# EAGLE design AutoFeatherDoubler (EAGLE 9.4.0)
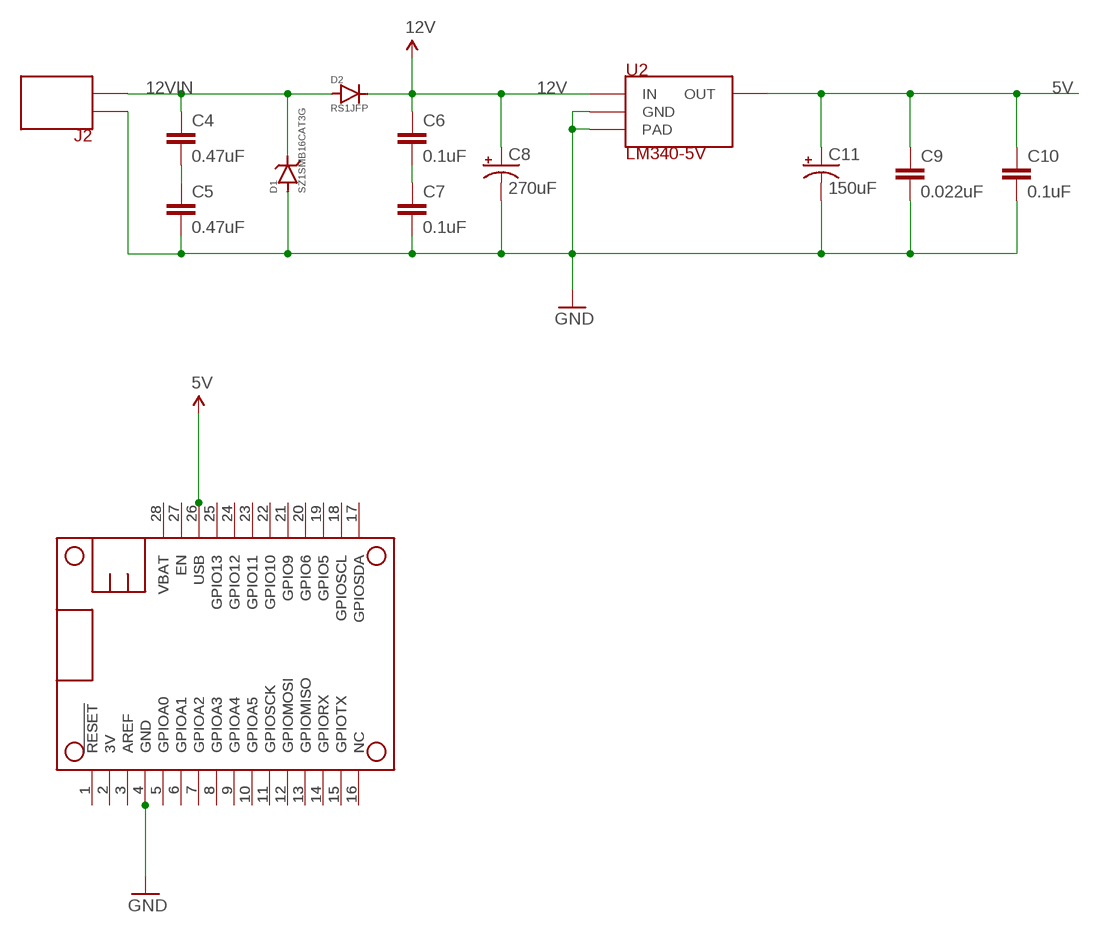
[diagram p0: schematic, sheet 1]

## Parts
C4  0.47uF  CAP-0.47UF-0805  [0805]
C5  0.47uF  CAP-0.47UF-0805  [0805]
C6  0.1uF  CAP-0.1UF-0603  [0603-CAP]
C7  0.1uF  CAP-0.1UF-0603  [0603-CAP]
C8  270uF  CAP-270UF-25V-RADIAL-PTH  [CAP-270UF-25V-RADIAL-PTH]
C9  0.022uF  CAP-0.022UF-0603  [0603-CAP]
C10  0.1uF  CAP-0.1UF-0603  [0603-CAP]
C11  150uF  CAP-150UF-25V-RADIAL-PTH  [CAP-150UF-25V-RADIAL-PTH]
D1  SZ1SMB16CAT3G  DIODE-TVS-SZ1SMB  [SZ1SMB]
D2  RS1JFP  DIODE-RS1JFP  [SOD-123HE-ON]
J2  TERMBLOCK-2X3.5MM  [TERMBLOCK-2X3.5MM]
MS1  FEATHERWING_NODIM  [FEATHERWING_DIM]
MS2  FEATHERWING_NODIM  [FEATHERWING_DIM]
U2  LM340-5V  LM340  [TO-263-3-TI]

## Nets
3V3: MS1.2(3V) MS2.2(3V)
5V: C9.1 C10.1 C11.+ MS1.26(USB) MS2.26(USB) U2.3(OUT)
12V: C6.1 C8.+ D2.1(CATHODE) U2.1(IN)
12VIN: C4.1 D1.C(CATHODE) D2.2(ANODE) J2.2
A0: MS1.5(GPIOA0) MS2.5(GPIOA0)
A1: MS1.6(GPIOA1) MS2.6(GPIOA1)
A2: MS1.7(GPIOA2) MS2.7(GPIOA2)
A3: MS1.8(GPIOA3) MS2.8(GPIOA3)
A4: MS1.9(GPIOA4) MS2.9(GPIOA4)
A5: MS1.10(GPIOA5) MS2.10(GPIOA5)
D2: MS1.19(GPIO5) MS2.19(GPIO5)
D3: MS1.20(GPIO6) MS2.20(GPIO6)
D4: MS1.21(GPIO9) MS2.21(GPIO9)
D5: MS1.22(GPIO10) MS2.22(GPIO10)
D6: MS1.23(GPIO11) MS2.23(GPIO11)
D7: MS1.24(GPIO12) MS2.24(GPIO12)
D8: MS1.25(GPIO13) MS2.25(GPIO13)
EN: MS1.27(EN) MS2.27(EN)
GND: C5.2 C7.2 C8.- C9.2 C10.2 C11.- D1.A(ANODE) J2.1 MS1.4(GND) MS2.4(GND) U2.2(GND) U2.PAD
MD: MS1.3(AREF) MS2.3(AREF)
MISO: MS1.13(GPIOMISO) MS2.13(GPIOMISO)
MOSI: MS1.12(GPIOMOSI) MS2.12(GPIOMOSI)
N$3: C4.2 C5.1
N$4: C6.2 C7.1
NC: MS1.16(NC) MS2.16(NC)
RESET: MS1.1(!RESET) MS2.1(!RESET)
RX: MS1.14(GPIORX) MS2.14(GPIORX)
SCK: MS1.11(GPIOSCK) MS2.11(GPIOSCK)
SCL: MS1.18(GPIOSCL) MS2.18(GPIOSCL)
SDA: MS1.17(GPIOSDA) MS2.17(GPIOSDA)
TX: MS1.15(GPIOTX) MS2.15(GPIOTX)
VBAT: MS1.28(VBAT) MS2.28(VBAT)

## Library data of the parts
C4 C5 = rickk2:CAP-0.47UF-0805: Wurth Electronics Inc. 885012207076 **not ordered yet** CAP CER 0.47UF 25V X7R 0805 0.47µF ±10% 25V Ceramic Capacitor X7R 0805 (2012 Metric) https://www.digikey.com/product-detail/en/wurth-electronics-inc/885012207076/732-7670-1-ND/5454297
C6 C7 C10 = rickk2:CAP-0.1UF-0603: CAP CER 0.1UF 16V X7R 0603 https://www.digikey.com/product-detail/en/murata-electronics-north-america/GRM188R71C104KA01D/490-1532-1-ND/587771
C8 = rickk2:CAP-270UF-25V-RADIAL-PTH: Wurth Electronics Inc. 860080474011 $0.36 **not ordered yet** CAP ALUM 270UF 20% 25V THRU HOLE 270µF 25V Aluminum Electrolytic Capacitors Radial, Can 3000 Hrs @ 105°C https://www.digikey.com/product-detail/en/wurth-electronics-inc/860080474011/732-9027-1-ND/5728970 Hole spacing: 3.5mm, lead size: 0.8mm, Diameter: 8.0mm
C9 = rickk2:CAP-0.022UF-0603: KEMET C0603C223K5RACTU $0.10 **not ordered yet** CAP CER 0.022UF (22nF) 50V X7R 0603 0.022µF ±10% 50V Ceramic Capacitor X7R 0603 (1608 Metric) https://www.digikey.com/product-detail/en/kemet/C0603C223K5RACTU/399-1280-1-ND/416056
C11 = rickk2:CAP-150UF-25V-RADIAL-PTH: Wurth Electronics Inc. 860020473010 $0.16 CAP ALUM 150UF 20% 25V RADIAL 150µF 25V Aluminum Electrolytic Capacitors Radial, Can 2000 Hrs @ 105°C https://www.digikey.com/product-detail/en/wurth-electronics-inc/860020473010/732-8827-1-ND/5728772 Hole spacing: 2.5mm, lead size: 0.8mm, Diameter: 6.3mm
D1 = rickk2:DIODE-TVS-SZ1SMB: Littelfuse Inc. SZ1SMB16CAT3G $0.97 **not purchased yet** TVS DIODE 16V 26V SMB 26V Clamp 23.1A Ipp Tvs Diode Surface Mount SMB https://www.digikey.com/products/en/circuit-protection/tvs-diodes/144?k=1SMB16CAT3G&k=&pkeyword=1SMB16CAT3G&sv=0&pv7=2&pv1989=0&sf=0&quantity=&ColumnSort=0&page=1&stock=1&pageSize=25 Unidirectional. Marking: LM Marking band on cathode side Device: DIODE-TVS-SZ1SMB
D2 = rickk2:DIODE-RS1JFP: Reverse voltage protection diode - not ordered yet! ON Semiconductor RS1JFP $0.44 DIODE GP 600V 1.2A SOD123HE Diode Standard 600V 1.2A Surface Mount SOD-123HE https://www.digikey.com/product-detail/en/on-semiconductor/RS1JFP/RS1JFPCT-ND/5722970 Used in Ford open power supply 1=Cathode=Large Pad=side with band 2=Anode=Small Pad
J2 = rickk2:TERMBLOCK-2X3.5MM
MS1 MS2 = microbuilder:FEATHERWING
U2 = rickk2:LM340: Texas Instruments LM340SX-5.0/NOPB $1.58 **not purchased yet** IC REG LIN 5V 1A DDPAK/TO263-3 Linear Voltage Regulator IC Positive Fixed 1 Output 1.5A DDPAK/TO-263-3 https://www.digikey.com/products/en?keywords=LM340SX-5.0%2FNOPBCT-ND

## Board
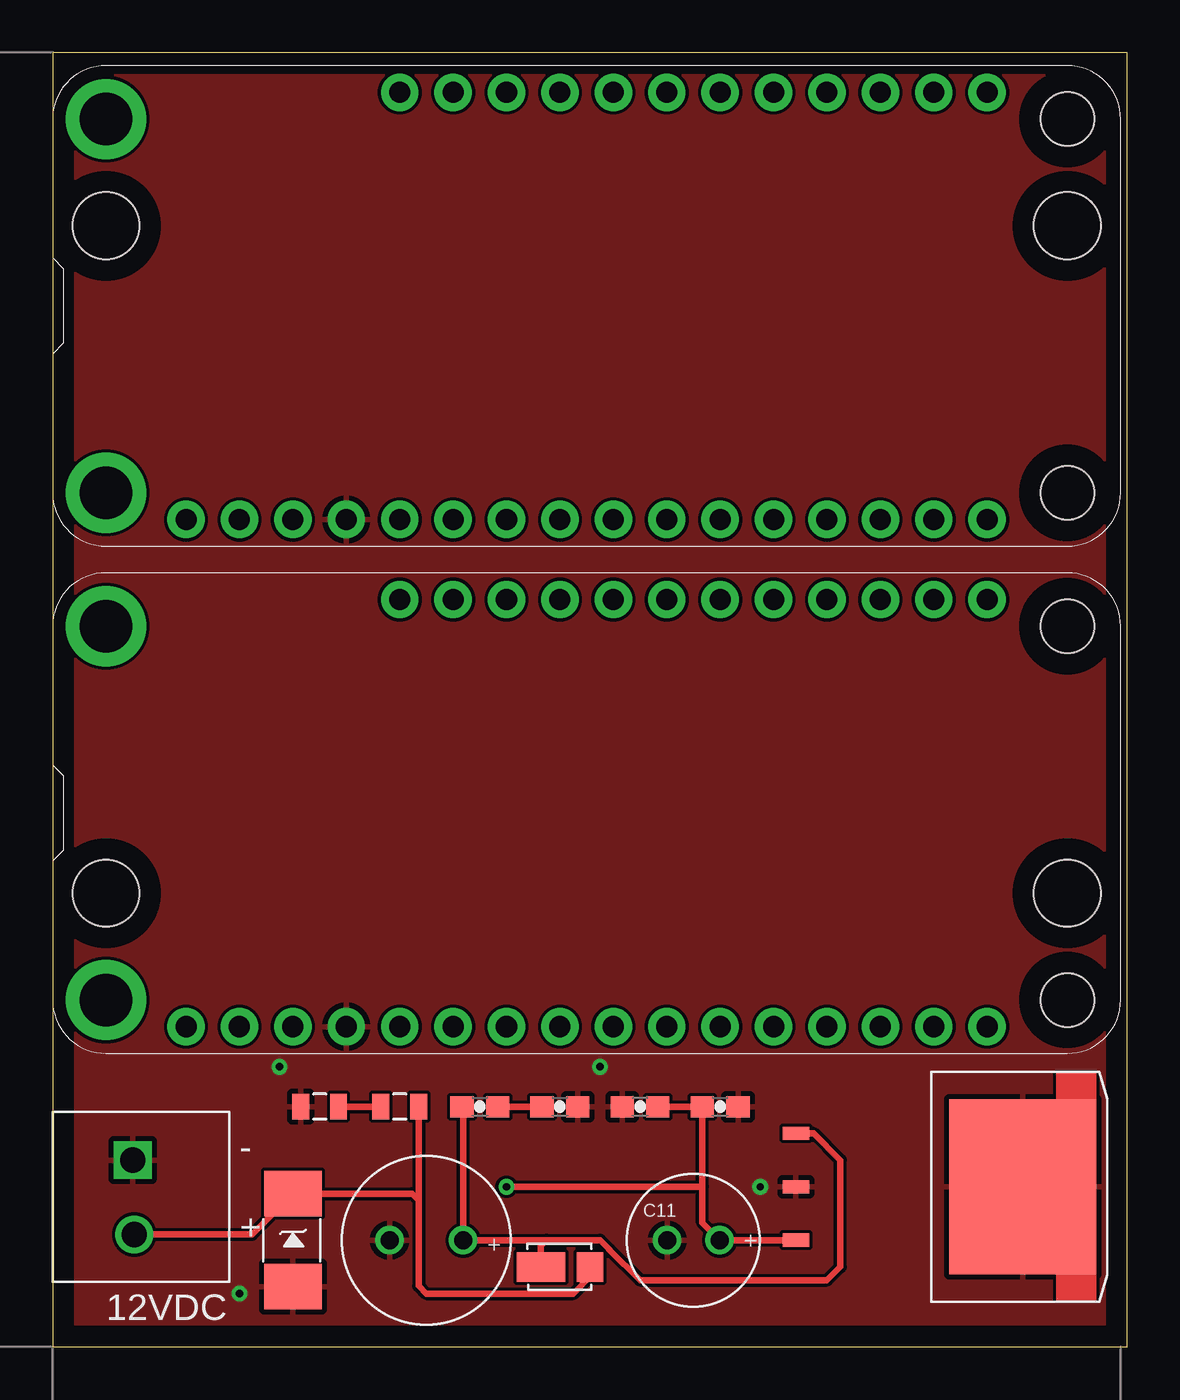
[diagram p1: board, top side]
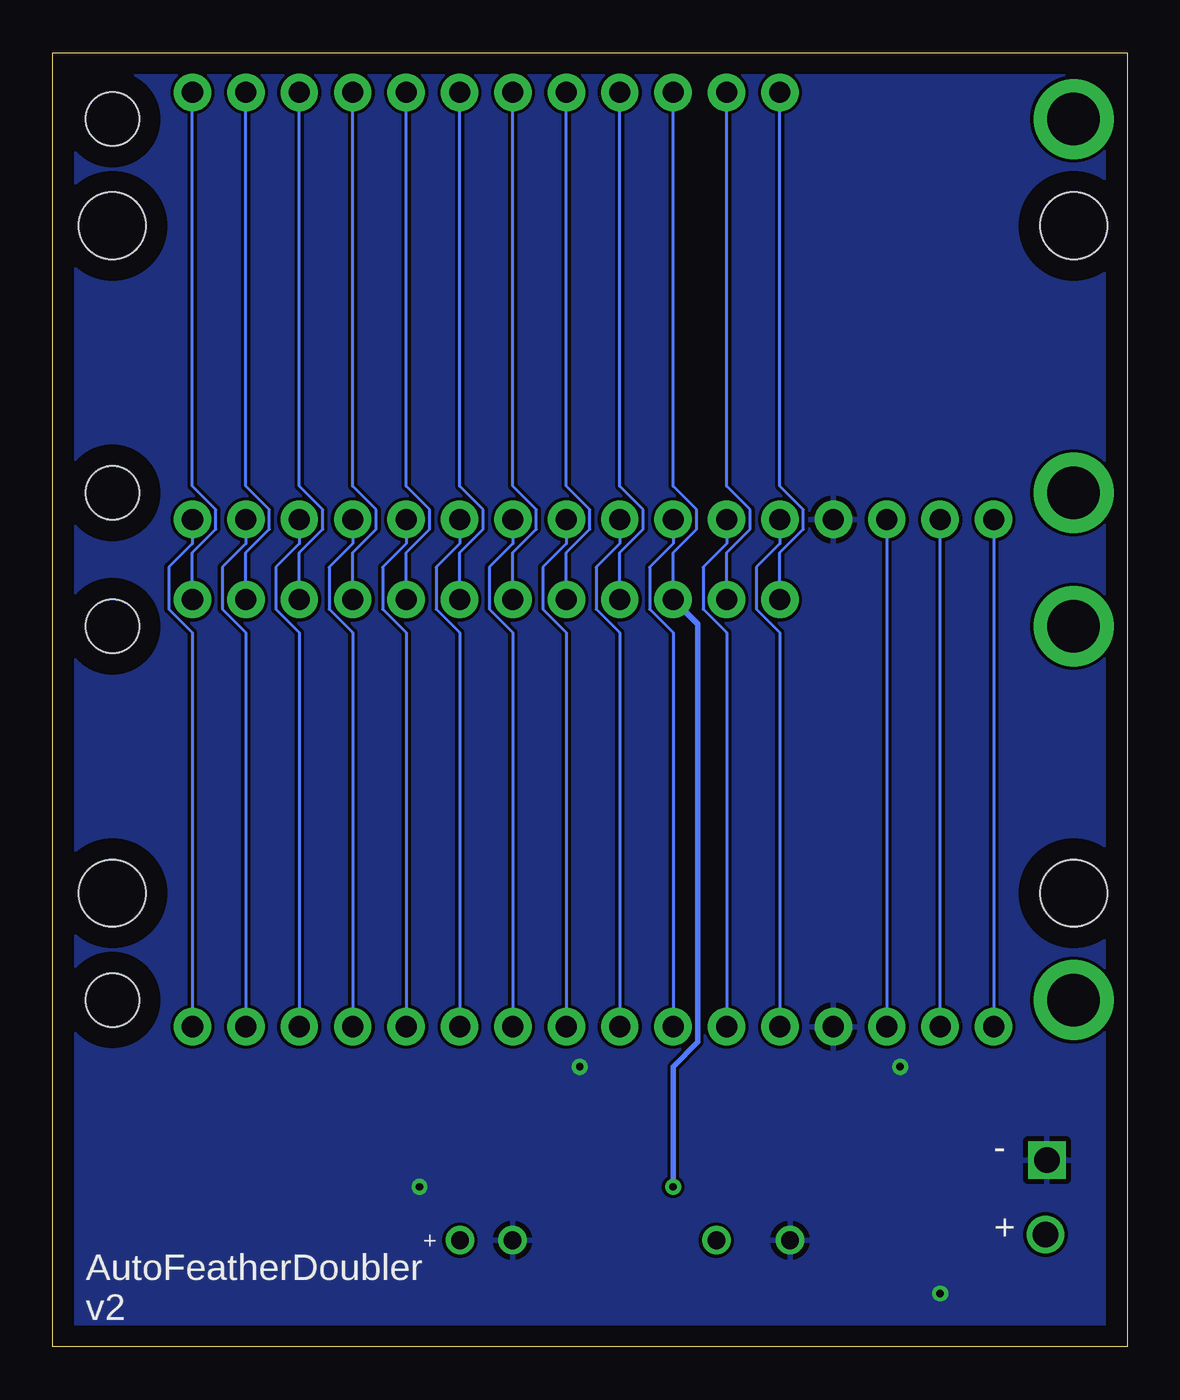
[diagram p2: board, bottom side, seen from below]

Size 51.1 x 61.59 mm. Coordinates in mm from the lower left corner, seen from the top.
Outline: 0,0 51.1,0 51.1,61.59 0,61.59 0,0
Copper layers (1*16): Top 0.035mm / dielectric 1.5mm / Bottom 0.035mm
Design rules "default": minimum track width 6mil, minimum drill 0.35mm, track to track 6mil, track to pad 6mil, pad to pad 6mil, via to via 6mil, smd to smd 6mil, copper to edge 40mil, drill to drill 6mil, minimum pad ring 10mil, minimum via ring 8mil, stop-mask expansion 4mil, vias tented up to drill 0mil, thermal gap 10mil
Holes 3.17 mm at 2.54,53.34 2.54,21.59 48.26,21.59 48.26,53.34

### Footprints (pad centres in the part's own frame; a part is rotated, then mirrored left to right if it is on the bottom)
0805 = smd 0.8 x 1.2: 1 -0.9,0; 2 0.9,0
0603-CAP = smd 1.1 x 1: 1 -0.85,0; 2 0.85,0
CAP-270UF-25V-RADIAL-PTH = drill 0.85: + 1.75,0; - -1.75,0
CAP-150UF-25V-RADIAL-PTH = drill 0.85: + 1.25,0; - -1.25,0
SZ1SMB = smd 2.159 x 2.743: A 2.21,0; C -2.21,0
SOD-123HE-ON = smd 2.3 x 1.4: 1 -0.9,0 | smd 1.25 x 1.4: 2 1.425,0
TERMBLOCK-2X3.5MM = drill 1.2 square: 1 0,0 | drill 1.2: 2 3.54,0.07
FEATHERWING_DIM = drill 1 pad 1.778: 1 6.35,1.27; 2 8.89,1.27; 3 11.43,1.27; 4 13.97,1.27; 5 16.51,1.27; 6 19.05,1.27; 7 21.59,1.27; 8 24.13,1.27; 9 26.67,1.27; 10 29.21,1.27; 11 31.75,1.27; 12 34.29,1.27; 13 36.83,1.27; 14 39.37,1.27; 15 41.91,1.27; 16 44.45,1.27; 17 44.45,21.59; 18 41.91,21.59; 19 39.37,21.59; 20 36.83,21.59; 21 34.29,21.59; 22 31.75,21.59; 23 29.21,21.59; 24 26.67,21.59; 25 24.13,21.59; 26 21.59,21.59; 27 19.05,21.59; 28 16.51,21.59 | drill 2.5 pad 3.81: P$1 2.54,20.32; P$2 2.54,2.54 | hole 2.54: 48.26,20.32; 48.26,2.54
TO-263-3-TI = smd 1.27 x 0.635: 1 7.188,-2.54; 2 7.188,0; 3 7.188,2.54 | smd 6.985 x 8.331: PAD -3.594,0

### Placement (x,y rotation side)
C4  16.51,11.43 180 top
C5  12.7,11.43 180 top
C6  20.32,11.43 0 top
C7  24.13,11.43 0 top
C8  17.78,5.08 0 top
C9  27.94,11.43 180 top
C10  31.75,11.43 0 top
C11  30.48,5.08 0 top
D1  11.43,5.08 270 top
D2  24.13,3.81 0 top
J2  3.81,8.89 270 top
MS1  0,13.97 0 top
MS2  0,38.1 0 top
U2  42.55,7.62 180 top

### Tracks (layer width: path | path; a pad name or v marks a point on that pad's centre or on a via)
3V3
  Bottom 0.152: MS1.2 MS2.2
5V  (via drill 0.35)
  Top 0.305: U2.3 C11.+ 30.9,5.91 30.9,7.62 | C9.1 C10.1 30.9,7.62 | v21.59,7.62 30.9,7.62
  Bottom 0.152: MS1.26 21.59,37.79 20.47,38.91 20.47,39.83 21.59,40.95 MS2.26
  Bottom 0.254: v21.59,7.62 21.59,13.34 20.42,14.5 20.42,34.39 MS1.26
12V
  Top 0.305: C6.1 19.53,11.37 C8.+ 23.5,5.08 | 23.5,5.08 26.04,5.08 26.48,4.64 26.48,4.63 27.94,3.17 36.83,3.17 37.47,3.81 37.47,8.89 36.2,10.16 U2.1 | D2.1 23.23,4.82 23.5,5.08
12VIN
  Top 0.305: J2.2 9.49,5.35 D1.C 17.11,7.29 17.41,6.99 | C4.1 17.41,6.99 | 17.41,6.99 17.41,2.91 17.78,2.54 24.77,2.54 25.55,3.33 D2.2
A0
  Bottom 0.152: MS2.5 16.51,38.22 17.63,37.1 17.63,35.1 16.51,33.98 MS1.5
A1
  Bottom 0.152: MS2.6 19.05,38.22 20.17,37.1 20.17,35.1 19.05,33.98 MS1.6
A2
  Bottom 0.152: MS2.7 21.59,38.22 22.71,37.1 22.71,35.1 21.59,33.98 MS1.7
A3
  Bottom 0.152: MS2.8 24.13,38.22 25.25,37.1 25.25,35.1 24.13,33.98 MS1.8
A4
  Bottom 0.152: MS2.9 26.67,38.22 27.79,37.1 27.79,35.1 26.67,33.98 MS1.9
A5
  Bottom 0.152: MS2.10 29.21,38.22 30.33,37.1 30.33,35.1 29.21,33.98 MS1.10
D2
  Bottom 0.152: MS1.19 39.37,37.79 38.25,38.91 38.25,39.83 39.37,40.95 MS2.19
D3
  Bottom 0.152: MS1.20 36.83,37.79 35.71,38.91 35.71,39.83 36.83,40.95 MS2.20
D4
  Bottom 0.152: MS1.21 34.29,37.79 33.17,38.91 33.17,39.83 34.29,40.95 MS2.21
D5
  Bottom 0.152: MS1.22 31.75,37.79 30.63,38.91 30.63,39.83 31.75,40.95 MS2.22
D6
  Bottom 0.152: MS1.23 29.21,37.79 28.09,38.91 28.09,39.83 29.21,40.95 MS2.23
D7
  Bottom 0.152: MS1.24 26.67,37.79 25.55,38.91 25.55,39.83 26.67,40.95 MS2.24
D8
  Bottom 0.152: MS1.25 24.13,37.79 23.01,38.91 23.01,39.83 24.13,40.95 MS2.25
EN
  Bottom 0.152: MS1.27 19.05,37.79 17.93,38.91 17.93,39.83 19.05,40.95 MS2.27
GND  (via drill 0.35)
  other vias: 10.79,13.34 8.89,2.54 26.04,13.34 33.66,7.62
  pour Top: 0,0 0,66.04 55.88,66.04 55.88,0
  pour Bottom: 0,0 0,64.77 57.15,64.77 57.15,0
MD
  Bottom 0.152: MS2.3 MS1.3
MISO
  Bottom 0.152: MS2.13 36.83,38.22 37.95,37.1 37.95,35.1 36.83,33.98 MS1.13
MOSI
  Bottom 0.152: MS2.12 34.29,38.22 35.41,37.1 35.41,35.1 34.29,33.98 MS1.12
N$3
  Top 0.305: C5.1 C4.2
N$4
  Top 0.305: C6.2 C7.1
NC
  Bottom 0.152: MS2.16 44.45,38.22 45.57,37.1 45.57,35.1 44.45,33.98 MS1.16
RESET
  Bottom 0.152: MS2.1 MS1.1
RX
  Bottom 0.152: MS2.14 39.37,38.22 40.49,37.1 40.49,35.1 39.37,33.98 MS1.14
SCK
  Bottom 0.152: MS2.11 31.75,38.22 32.87,37.1 32.87,35.1 31.75,33.98 MS1.11
SCL
  Bottom 0.152: MS1.18 41.91,37.79 40.79,38.91 40.79,39.83 41.91,40.95 MS2.18
SDA
  Bottom 0.152: MS1.17 44.45,37.79 43.33,38.91 43.33,39.83 44.45,40.95 MS2.17
TX
  Bottom 0.152: MS2.15 41.91,38.22 43.03,37.1 43.03,35.1 41.91,33.98 MS1.15
VBAT
  Bottom 0.152: MS1.28 16.51,37.79 15.39,38.91 15.39,39.83 16.51,40.95 MS2.28

### Text on the board
tPlace: - | + | + | 12VDC
bPlace: - | + | AutoFeatherDoubler / v2